# EasyEDA Pro project CALU_BMS_V1.3.0.0.epro, schematic Schematic1
Board Name: SSR; Create Date: 2025-09-18; Page Name: P1; Project Name: CALU_BMS; Schematic Name: Schematic1; Update Date: 2025-09-18; Company: EasyEDA.com; Page Size: A4; Version: V1.0
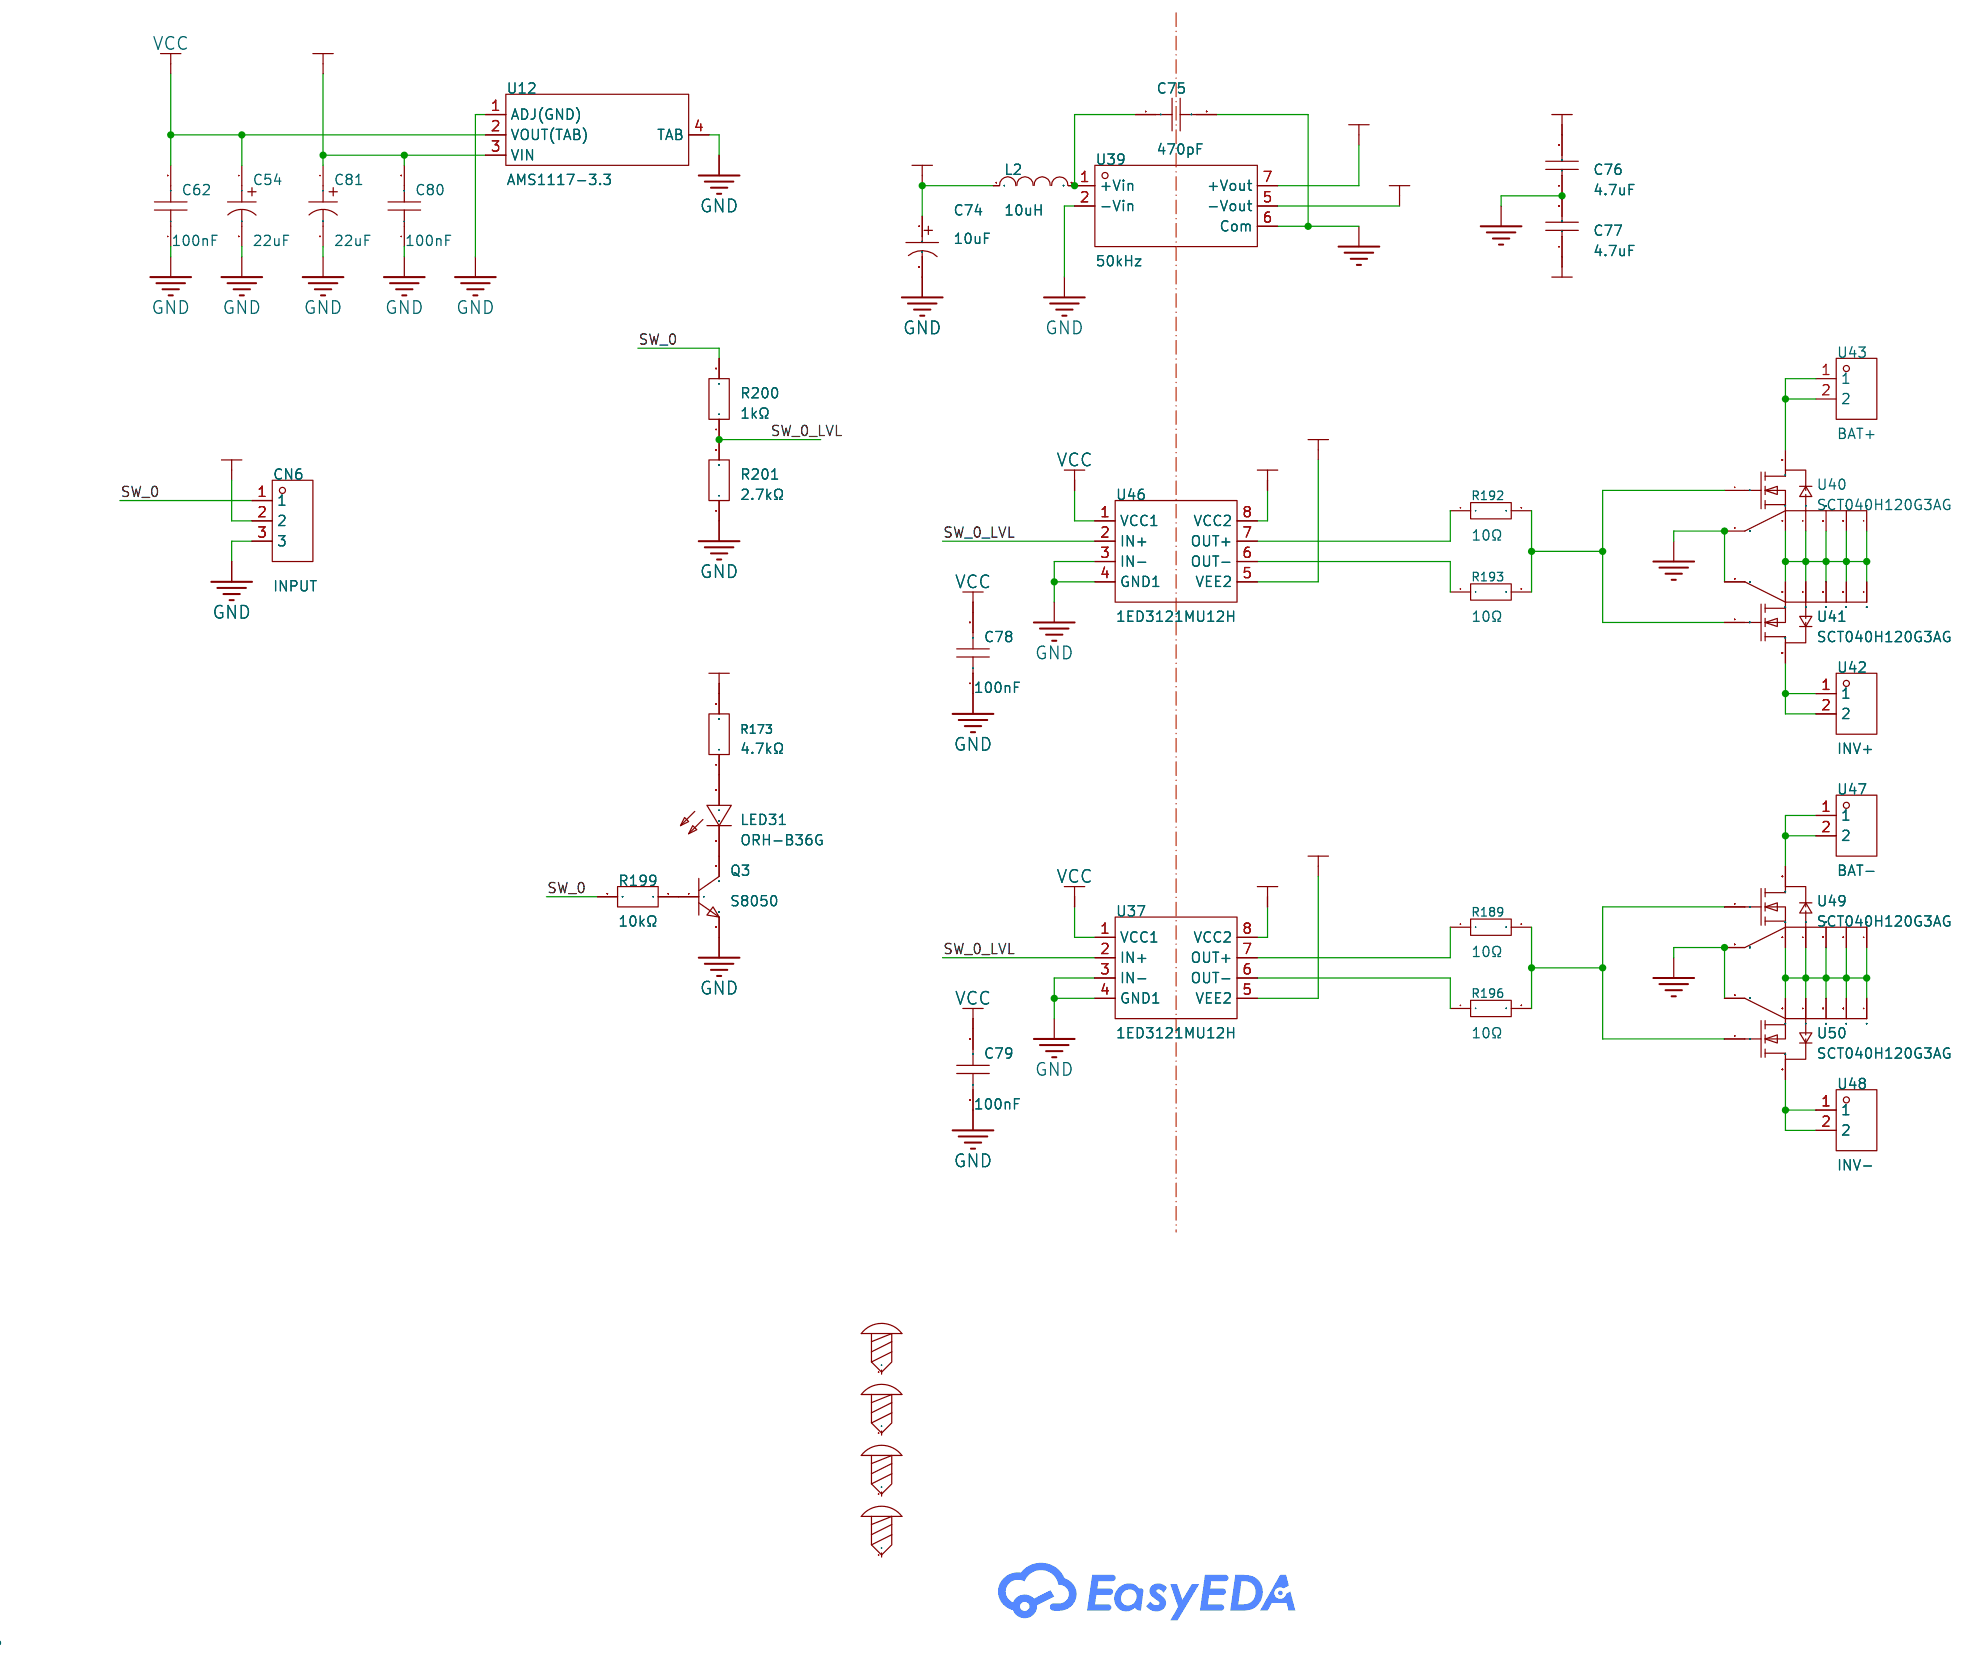
[diagram p0: schematic sheet]

## Parts
C54  22uF  [CAP-SMD_BD5.0-L5.3-W5.3-LS6.0-FD]
C62  100nF  [C0603]
C74  10uF  [CAP-SMD_BD4.0-L4.3-W4.3-FD]
C75  470pF  [C1210]
C76  4.7uF  [C1206]
C77  4.7uF  [C1206]
C78  100nF  [C0603]
C79  100nF  [C0603]
C80  100nF  [C0603]
C81  22uF  [CAP-SMD_BD5.0-L5.3-W5.3-LS6.0-FD]
CN6  INPUT  [CONN-TH_3P-P3.50_MAX_MX15EDGRM-3.5-GN01-03P-CU-A]
L2  10uH  [L0603]
LED31  ORH-B36G  [LED0603-RD]
Q3  S8050  [SOT-23-3_L2.9-W1.6-P1.90-LS2.8-BR]
R173  4.7kΩ  [R0603]
R189  10Ω  [R0603]
R192  10Ω  [R0603]
R193  10Ω  [R0603]
R196  10Ω  [R0603]
R199  10kΩ  [R0603]
R200  1kΩ  [R0603]
R201  2.7kΩ  [R0603]
SCREW1  -  [Screw-Hole-M4]
SCREW2  -  [Screw-Hole-M4]
SCREW3  -  [Screw-Hole-M4]
SCREW4  -  [Screw-Hole-M4]
U12  AMS1117-3.3  [SOT-223-4_L6.5-W3.5-P2.30-LS7.0-BR]
U37  1ED3121MU12H  [PG-DSO-8_L7.5-W6.4-P1.27-LS10.3-BL]
U39  50kHz  [PWRM-TH_5P-L19.5-W9.8_YLPTEC_RXXP2XX]
U40  SCT040H120G3AG  [H2PAK-7_L10.4-W10.0-P1.27-LS15.0-BL]
U41  SCT040H120G3AG  [H2PAK-7_L10.4-W10.0-P1.27-LS15.0-BL]
U42  INV+  [CONN-TH_JILN_JL136HT-101601G01]
U43  BAT+  [CONN-TH_JILN_JL136HT-101601G01]
U46  1ED3121MU12H  [PG-DSO-8_L7.5-W6.4-P1.27-LS10.3-BL]
U47  BAT-  [CONN-TH_JILN_JL136HT-101601G01]
U48  INV-  [CONN-TH_JILN_JL136HT-101601G01]
U49  SCT040H120G3AG  [H2PAK-7_L10.4-W10.0-P1.27-LS15.0-BL]
U50  SCT040H120G3AG  [H2PAK-7_L10.4-W10.0-P1.27-LS15.0-BL]

## Library data of the parts
C54 C81 = CS1E220M-CRD54_C3001207: Capacitance:22uF Tolerance:±20% Tolerance:±20% Voltage Rating:25V Ripple Current:25mA@120Hz Diameter:5mm Height - Seated (Max):5.4mm Lifetime:2000hrs@105℃ Operating Temperature:-40℃~+105℃ Operating Temperature:-40℃~+105℃; LCSC Part Name: 22uF ±20% 25V; Supplier Part: C3001207; Manufacturer: ROQANG(容强); Manufacturer Part: CS1E220M-CRD54; Supplier Footprint: SMD,D5xL5.4mm; JLCPCB Part Class: Extended Part; Datasheet: https://item.szlcsc.com/datasheet/CS1E220M-CRD54/3483887.html; Supplier: LCSC; Tolerance: ±20%; Voltage Rating: 25V; Ripple Current: 25mA@120Hz; Diameter: 5mm; Height - Seated (Max): 5.4mm; Lifetime: 2000hrs@105℃; Operating Temperature: -40℃~+105℃
C62 C78-C80 = CC0603KRX7R9BB104: Capacitance:100nF Tolerance:±10% Tolerance:±10% Voltage Rating:50V Temperature Coefficient:X7R; LCSC Part Name: 100nF ±10% 50V; Supplier Part: C14663; Manufacturer: YAGEO(国巨); Supplier Footprint: 0603; JLCPCB Part Class: Basic Part; Datasheet: https://item.szlcsc.com/datasheet/CC0603KRX7R9BB104/15331.html; Supplier: LCSC; Tolerance: ±10%; Voltage Rating: 50V; Temperature Coefficient: X7R
C74 = RVT1V100M0405_C72485: Capacitance:10uF Tolerance:±20% Tolerance:±20% Voltage Rating:35V Ripple Current:15mA@120Hz Equivalent Series Resistance(ESR):- Diameter:4mm Height - Seated (Max):5.4mm Lifetime:2000hrs@105℃ Operating Temperature:-40℃~+105℃ Operating Temperature:-40℃~+105; LCSC Part Name: 10uF ±20% 35V; Supplier Part: C72485; Manufacturer: ROQANG(容强); Manufacturer Part: RVT1V100M0405; Supplier Footprint: SMD,D4xL5.4mm; JLCPCB Part Class: Extended Part; Datasheet: https://item.szlcsc.com/datasheet/RVT1V100M0405/73596.html; Supplier: LCSC; Tolerance: ±20%; Voltage Rating: 35V; Ripple Current: 15mA@120Hz; Diameter: 4mm; Height - Seated (Max): 5.4mm; Lifetime: 2000hrs@105℃; Operating Temperature: -40℃~+105℃
C75 = FV32X471K202EEG: Capacitance:470pF Tolerance:±10% Tolerance:±10% Voltage Rating:2kV Temperature Coefficient:X7R; LCSC Part Name: 470pF ±10% 2kV; Supplier Part: C146199; Manufacturer: PSA(信昌电陶); Supplier Footprint: 1210; JLCPCB Part Class: Extended Part; Datasheet: https://item.szlcsc.com/datasheet/FV32X471K202EEG/157531.html; Supplier: LCSC; Tolerance: ±10%; Voltage Rating: 2kV; Temperature Coefficient: X7R
C76 C77 = CL31B475KBHNNNE: Capacitance:4.7uF Tolerance:±10% Tolerance:±10% Voltage Rating:50V Temperature Coefficient:X7R; LCSC Part Name: 4.7uF ±10% 50V; Supplier Part: C51205; Manufacturer: SAMSUNG(三星); Supplier Footprint: 1206; JLCPCB Part Class: Extended Part; Datasheet: https://item.szlcsc.com/datasheet/CL31B475KBHNNNE/52218.html; Supplier: LCSC; Tolerance: ±10%; Voltage Rating: 50V; Temperature Coefficient: X7R
CN6 = MX15EDGRM-3.5-03P-GN01-Cu-A: Connector Type:Board Side/Socket - Closed Termination Style:Screw Number of Positions or Pins:1x3P Pitch:3.5mm Color:Green Mounting Type:Right-Angle Pin Number of Pins:3P Number of Rows:1 Number of PINs Per Row:3 Current Rating:8A Voltage Rating (Max):300; LCSC Part Name: 螺丝固定 1x3P 3.5mm 排数:1 每排P数:3; Supplier Part: C5188342; Manufacturer: MAX(迈旭); Supplier Footprint: 弯插,P=3.5mm; JLCPCB Part Class: Extended Part; Datasheet: https://item.szlcsc.com/datasheet/MX15EDGRM-3.5-03P-GN01-Cu-A/5862426.html; Supplier: LCSC; Connector Type: Board Side/Socket - Closed; Termination Style: Screw; Number of Positions or Pins: 1x3P; Pitch: 3.5mm; Color: Green; Mounting Type: Right-Angle Pin; Number of Pins: 3P; Number of Rows: 1; Number of PINs Per Row: 3; Current Rating: 8A; Voltage Rating (Max): 300V; Operating Temperature: -40℃~+105℃
L2 = LQM18FN100M00D: Inductance:10uH Tolerance:±20% Tolerance:±20% Current Rating:50mA Current - Saturation (Isat):50mA DC Resistance(DCR):1.17Ω Q @ Frequency:- Frequency - Self Resonant:30MHz Ratings:-; LCSC Part Name: 10uH ±20% 50mA 停产; Supplier Part: C86083; Manufacturer: muRata(村田); Supplier Footprint: 0603; JLCPCB Part Class: Extended Part; Datasheet: https://item.szlcsc.com/datasheet/LQM18FN100M00D/87259.html; Supplier: LCSC; Tolerance: ±20%; Current Rating: 50mA; Current - Saturation (Isat): 50mA; DC Resistance(DCR): 1.17Ω; Frequency - Self Resonant: 30MHz
LED31 = ORH-B36G: Emitted Color:Blue Forward Voltage (VF):2.6V~3.1V Forward Voltage (VF):2.6V~3.1V Power Dissipation:100mW Forward Current:2mA Dominant Wavelength:458nm~475nm Dominant Wavelength:458nm~475nm Peak Wavelength:460nm Diode Configuration:- Lens Color:Colorless t; Supplier Part: C193191; Manufacturer: Orient(奥伦德); Supplier Footprint: 0603; JLCPCB Part Class: Extended Part; Datasheet: https://atta.szlcsc.com/upload/public/pdf/source/20180629/C193191_B3945EB375B4464C1EA8B70EB4C9D3B5.pdf; Supplier: LCSC; Emitted Color: Blue; Forward Voltage (VF): 2.6V~3.1V; Power Dissipation: 100mW; Forward Current: 2mA; Dominant Wavelength: 458nm~475nm; Peak Wavelength: 460nm; Lens Color: Colorless transparent lens; Luminous Intensity: 23mcd~53mcd; Viewing Angle: 130°; Operating Temperature: -40℃~+85℃
Q3 = S8050_C181158: Transistor Type: Collector Current (Ic): Collector-Emitter Breakdown Voltage (Vceo): Power Dissipation (Pd): Transition Frequency (fT):150MHz Collector Cut-Off Current (Icbo):100nA Collector-Emitter Saturation Voltage (VCE(sat)@Ic,Ib):600mV@500mA,50mA Ope; LCSC Part Name: NPN 电流:500mA 耐压:25V H档; Supplier Part: C181158; Manufacturer: Hottech(合科泰); Supplier Footprint: SOT-23; JLCPCB Part Class: Extended Part; Datasheet: https://atta.szlcsc.com/upload/public/pdf/source/20220506/D987F39D56F2975D34EC7947E75C4ABC.pdf; Supplier: LCSC; Transition Frequency (fT): 150MHz; Collector Cut-Off Current (Icbo): 100nA; Collector-Emitter Saturation Voltage (VCE(sat)@Ic,Ib): 600mV@500mA,50mA
R173 = FRC0603J472 TS: Type:Thick Film Resistor Resistance:4.7kΩ Tolerance:±5% Tolerance:±5% Power(Watts):100mW Voltage-Supply(Max):75V Temperature Coefficient:±100ppm/℃ Temperature Coefficient:±100ppm/℃ Operating Temperature:-55℃~+155℃ Operating Temperature:-55℃~+155℃; LCSC Part Name: 4.7kΩ ±5% 100mW 厚膜电阻; Supplier Part: C2907166; Manufacturer: FOJAN(富捷); Supplier Footprint: 0603; JLCPCB Part Class: Extended Part; Supplier: LCSC; Type: Thick Film Resistor; Tolerance: ±5%; Power(Watts): 100mW; Voltage-Supply(Max): 75V; Temperature Coefficient: ±100ppm/℃; Operating Temperature: -55℃~+155℃
R189 R192 R193 R196 = 0603WAF100JT5E: Type:Thick Film Resistor Resistance:10Ω Tolerance:±1% Tolerance:±1% Power(Watts):100mW Voltage-Supply(Max):75V Temperature Coefficient:±400ppm/℃ Temperature Coefficient:±400ppm/℃ Operating Temperature:-55℃~+155℃ Operating Temperature:-55℃~+155℃; LCSC Part Name: 10Ω ±1% 100mW 厚膜电阻; Supplier Part: C22859; Manufacturer: UNI-ROYAL(厚声); Supplier Footprint: 0603; JLCPCB Part Class: Basic Part; Datasheet: https://item.szlcsc.com/datasheet/0603WAF100JT5E/23586.html; Supplier: LCSC; Type: Thick Film Resistor; Tolerance: ±1%; Power(Watts): 100mW; Voltage-Supply(Max): 75V; Temperature Coefficient: ±400ppm/℃; Operating Temperature: -55℃~+155℃
R199 = FRC0603F1002TS: Type:Thick Film Resistor Resistance:10kΩ Tolerance:±1% Tolerance:±1% Power(Watts):100mW Voltage-Supply(Max):75V Temperature Coefficient:±100ppm/℃ Temperature Coefficient:±100ppm/℃ Operating Temperature:-55℃~+155℃ Operating Temperature:-55℃~+155℃; LCSC Part Name: 10kΩ ±1% 100mW 厚膜电阻; Supplier Part: C2906982; Manufacturer: FOJAN(富捷); Supplier Footprint: 0603; JLCPCB Part Class: Extended Part; Supplier: LCSC; Type: Thick Film Resistor; Tolerance: ±1%; Power(Watts): 100mW; Voltage-Supply(Max): 75V; Temperature Coefficient: ±100ppm/℃; Operating Temperature: -55℃~+155℃
R200 = FRC0603F1001TS: Type:Thick Film Resistor Resistance:1kΩ Tolerance:±1% Tolerance:±1% Power(Watts):100mW Voltage-Supply(Max):75V Temperature Coefficient:±100ppm/℃ Temperature Coefficient:±100ppm/℃ Operating Temperature:-55℃~+155℃ Operating Temperature:-55℃~+155℃; LCSC Part Name: 1kΩ ±1% 100mW 厚膜电阻; Supplier Part: C2907002; Manufacturer: FOJAN(富捷); Supplier Footprint: 0603; JLCPCB Part Class: Extended Part; Supplier: LCSC; Type: Thick Film Resistor; Tolerance: ±1%; Power(Watts): 100mW; Voltage-Supply(Max): 75V; Temperature Coefficient: ±100ppm/℃; Operating Temperature: -55℃~+155℃
R201 = FRC0603F2701TS: Type:Thick Film Resistor Resistance:2.7kΩ Tolerance:±1% Tolerance:±1% Power(Watts):100mW Voltage-Supply(Max):75V Temperature Coefficient:±100ppm/℃ Temperature Coefficient:±100ppm/℃ Operating Temperature:-55℃~+155℃ Operating Temperature:-55℃~+155℃; LCSC Part Name: 2.7kΩ ±1% 100mW 厚膜电阻; Supplier Part: C2907008; Manufacturer: FOJAN(富捷); Supplier Footprint: 0603; JLCPCB Part Class: Extended Part; Supplier: LCSC; Type: Thick Film Resistor; Tolerance: ±1%; Power(Watts): 100mW; Voltage-Supply(Max): 75V; Temperature Coefficient: ±100ppm/℃; Operating Temperature: -55℃~+155℃
SCREW1-SCREW4 = Screw-Hole-M4: Supplier Footprint: 插件; Check: false
U12 = AMS1117-3.3_C347222: Output Type:Fixed Voltage - Supply:12V Output Voltage:3.3V Output Voltage:3.3V Output Current:1A Power Supply Rejection Ratio (PSRR):60dB@(120Hz) Voltage Dropout:1.3V@(1A) standby current:- Noise:- Features:Overcurrent Protection Operating Temperature:- O; LCSC Part Name: 输出:3.3V 电流:1A 耐压:12V; Supplier Part: C347222; Manufacturer: UMW(友台半导体); Supplier Footprint: SOT-223; JLCPCB Part Class: Extended Part; Datasheet: https://item.szlcsc.com/datasheet/AMS1117-3.3/323882.html; Supplier: LCSC; Output Type: Fixed; Voltage - Supply: 12V; Output Voltage: 3.3V; Output Current: 1A; Power Supply Rejection Ratio (PSRR): 60dB@(120Hz); Voltage Dropout: 1.3V@(1A); Features: Overcurrent Protection; Output Configuration: Positive electrode; Number of Outputs: 1
U37 U46 = 1ED3121MU12H: Driven Configuration:Half-Bridge Load Type:IGBT；MOSFET；SiC MOSFET Number of Drivers:1 Current - Output Low(IOL):5.5A Current - Output High(IOH):5.5A Voltage - Supply:10V~35V Voltage - Supply:10V~35V Fall Time:15ns Propagation Delay tpLH:90ns Propagation D; Supplier Part: C530922; Manufacturer: Infineon(英飞凌); Supplier Footprint: DSO-8; JLCPCB Part Class: Extended Part; Datasheet: https://item.szlcsc.com/datasheet/1ED3121MU12H/553430.html; Supplier: LCSC; Driven Configuration: Half-Bridge; Load Type: IGBT；MOSFET；SiC MOSFET; Number of Drivers: 1; Current - Output Low(IOL): 5.5A; Current - Output High(IOH): 5.5A; Voltage - Supply: 10V~35V; Fall Time: 15ns; Propagation Delay tpLH: 90ns; Propagation Delay tpHL: 90ns; Features: Under Voltage Protection；Short Circuit Protection; Operating Temperature: -40℃~+125℃
U39 = R12P21509D: Type:- Number of Channels:2 Output Power:2W Voltage - Supply:12V Voltage - Supply:12V Conversion Efficiency:90% Conversion Efficiency:90% Output Voltage:-9V；15V Output Voltage:-9V；15V Output Current(Max):67mA；-111mA Output Current(Max):67mA；-111mA Capacit; LCSC Part Name: DC/DC模块电源; Supplier Part: C18212306; Manufacturer: YLPTEC(易川); Supplier Footprint: SIP,19.5x9.8mm; JLCPCB Part Class: Extended Part; Datasheet: https://item.szlcsc.com/datasheet/R12P21509D/19382646.html; Supplier: LCSC; Number of Channels: 2; Output Power: 2W; Voltage - Supply: 12V; Conversion Efficiency: 90%; Output Voltage: -9V；15V; Output Current(Max): 67mA；-111mA; Capacitive Load(Max): 330uF; Isolation Voltage(Vrms): 3kV@AC; Features: Short Circuit Protection; Operating Temperature: -40℃~+90℃; Ripple Noise: 200mVp-p; Length: 19.5mm; Width: 9.8mm; Height: 12.5mm
U40 U41 U49 U50 = SCT040H120G3AG: Drain to Source Voltage:1.2kV Current - Continuous Drain(Id):40A Pd - Power Dissipation:300W Gate Threshold Voltage (Vgs(th)):4.2V Gate Charge(Qg):54nC Ciss-Input Capacitance:1.329nF Reverse Transfer Capacitance (Crss):10pF Operating Temperature:-55℃~+175; Supplier Part: C28224958; Manufacturer: ST(意法半导体); Supplier Footprint: H2PAK-7; JLCPCB Part Class: Extended Part; Datasheet: https://item.szlcsc.com/datasheet/SCT040H120G3AG/29963518.html; Supplier: LCSC; Drain to Source Voltage: 1.2kV; Current - Continuous Drain(Id): 40A; Pd - Power Dissipation: 300W; Gate Threshold Voltage (Vgs(th)): 4.2V; Gate Charge(Qg): 54nC; Ciss-Input Capacitance: 1.329nF; Reverse Transfer Capacitance (Crss): 10pF; Operating Temperature: -55℃~+175℃; Output Capacitance(Coss): 78pF; RDS(on): 54mΩ
U42 U43 U47 U48 = JL136HT-101601G01: Structure:1x1P Pitch:10.16mm Color:Green Mounting Style:Direct Insert Number of Pins:1P Number of Rows:1 Number of PINs Per Row:1 Screw Specification:M4 Current Rating (Max):65A Voltage Rating (Max):1kV Wire Gauge - AWG:6~20 Wire Gauge - AWG:6~20 Wire Gau; LCSC Part Name: 1x1P 10.16mm 直插 排数:1 每排P数:1; Supplier Part: C2908420; Manufacturer: JILN(锦凌); Supplier Footprint: 插件,P=10.16mm; JLCPCB Part Class: Extended Part; Datasheet: https://atta.szlcsc.com/upload/public/pdf/source/20211026/C480E0167F9E46BFD3461AA68F751918.pdf; Supplier: LCSC; Structure: 1x1P; Pitch: 10.16mm; Color: Green; Mounting Style: Direct Insert; Number of Pins: 1P; Number of Rows: 1; Number of PINs Per Row: 1; Screw Specification: M4; Current Rating (Max): 65A; Voltage Rating (Max): 1kV; Wire Gauge - AWG: 6~20; Wire Gauge - mm2: 2.5~16; Operating Temperature Range: -40℃~+105℃

## Nets
+12V: C74.1 C80.2 C81.1 CN6.2 L2.1 R173.2 U12.3(VIN)
+15V_ISO: C76.2 U37.8(VCC2) U39.7(+Vout) U46.8(VCC2)
-9V_ISO: C77.1 U37.5(VEE2) U39.5(-Vout) U46.5(VEE2)
GND: C54.2 C62.1 C74.2 C78.1 C79.1 C80.1 C81.2 CN6.3 Q3.2 R201.1 U12.1(ADJ(GND)) U12.4(TAB) U37.3(IN-) U37.4(GND1) U39.2(-Vin) U46.3(IN-) U46.4(GND1)
GND_ISO: C75.2 C76.1 C77.2 U39.6(Com) U40.2(DS) U41.2(DS) U49.2(DS) U50.2(DS)
VCC: C54.1 C62.2 C78.2 C79.2 U12.2(VOUT(TAB)) U37.1(VCC1) U46.1(VCC1)
SW_0: CN6.1 R199.2 R200.2
SW_0_LVL: R200.1 R201.2 U37.2(IN+) U46.2(IN+)
$1N561: R189.1 U37.7(OUT+)
$1N564: R196.1 U37.6(OUT-)
$1N567: R189.2 R196.2 U49.1(G) U50.1(G)
$1N591: U40.3(S) U40.4(S) U40.5(S) U40.6(S) U40.7(S) U41.3(S) U41.4(S) U41.5(S) U41.6(S) U41.7(S)
$1N980: C75.1 L2.2 U39.1(+Vin)
$1N1089: LED31.2(A) R173.1
$1N1249: LED31.1(C) Q3.3
$1N1560: R192.1 U46.7(OUT+)
$1N1563: R193.1 U46.6(OUT-)
$1N1566: R192.2 R193.2 U40.1(G) U41.1(G)
$1N1634: U40.8(D) U43.1 U43.2
$1N1649: U41.8(D) U42.1 U42.2
$1N1712: U47.1 U47.2 U49.8(D)
$1N1759: U48.1 U48.2 U50.8(D)
$1N2377: U49.3(S) U49.4(S) U49.5(S) U49.6(S) U49.7(S) U50.3(S) U50.4(S) U50.5(S) U50.6(S) U50.7(S)
$1N3140: Q3.1 R199.1

Not connected (* = marked no-connect by the designer): SCREW1 1; SCREW2 1; SCREW3 1; SCREW4 1
